# Altium schematic sheet STM32WB55 Main MCU.SchDoc
size A3; SheetNumber: 6; SheetTotal: 6
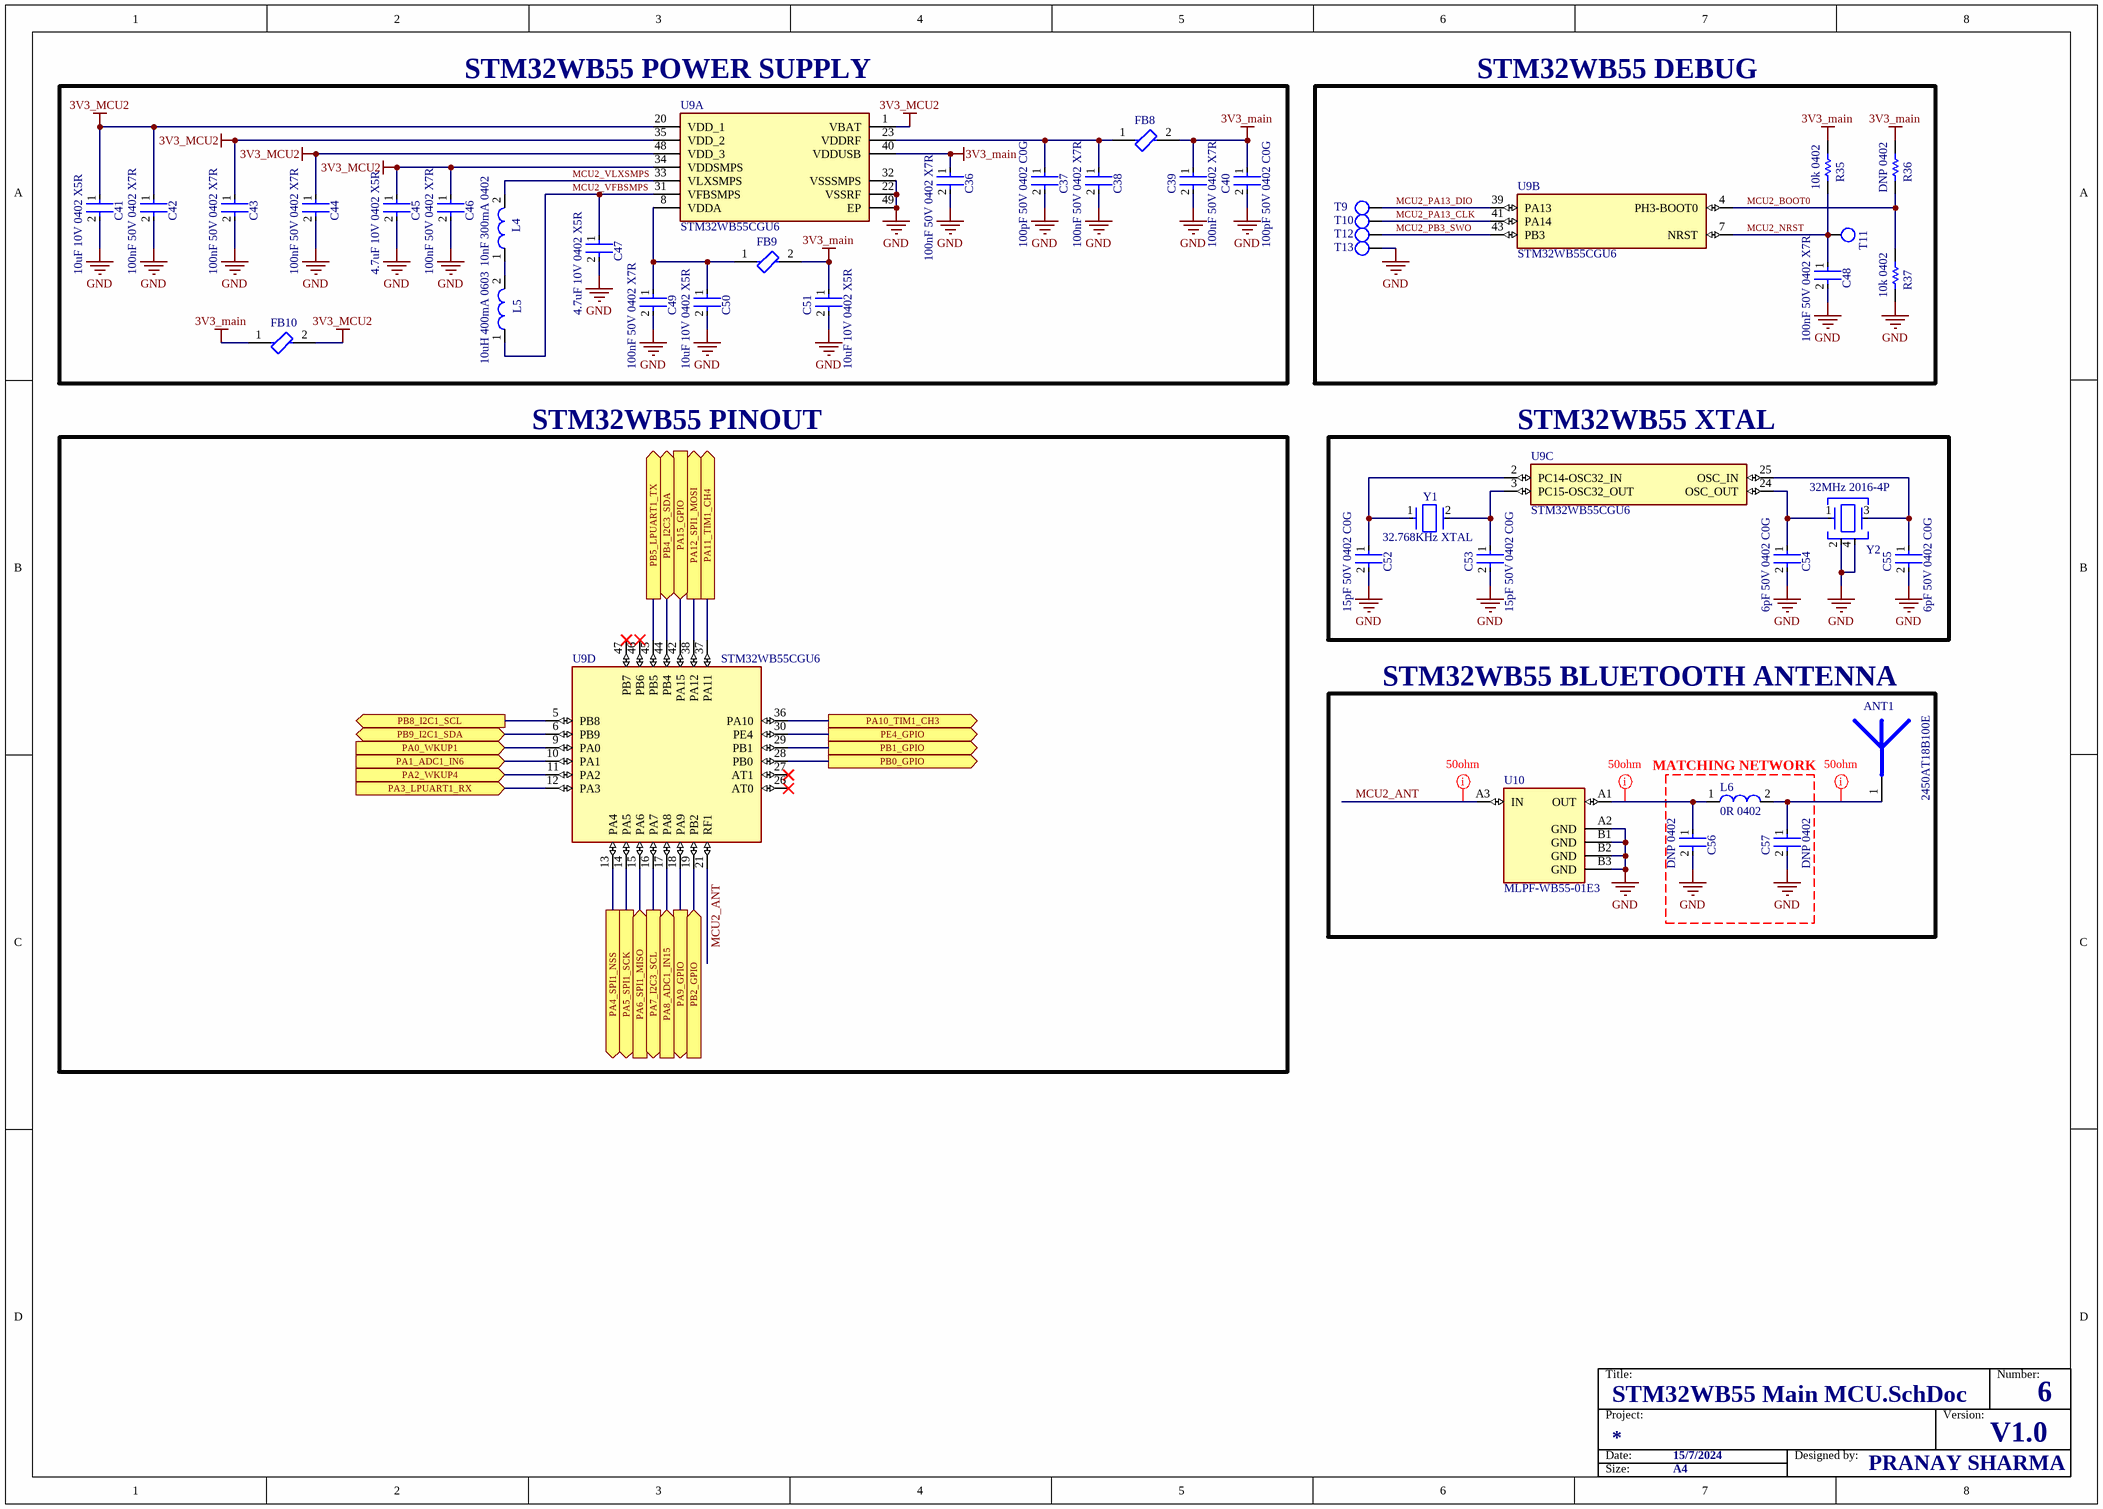
[diagram p0: STM32WB55 Main MCU.SchDoc]

## Parts
ANT1  2450AT18B100E  [2450AT18B100E IPC-C]
C36  100nF 50V 0402 X7R  [0402 IPC CLASS C CAPACITOR]
C37  100pF 50V 0402 C0G  [0402 IPC CLASS C CAPACITOR]
C38  100nF 50V 0402 X7R  [0402 IPC CLASS C CAPACITOR]
C39  100nF 50V 0402 X7R  [0402 IPC CLASS C CAPACITOR]
C40  100pF 50V 0402 C0G  [0402 IPC CLASS C CAPACITOR]
C41  10uF 10V 0402 X5R  [0402 IPC CLASS C CAPACITOR]
C42  100nF 50V 0402 X7R  [0402 IPC CLASS C CAPACITOR]
C43  100nF 50V 0402 X7R  [0402 IPC CLASS C CAPACITOR]
C44  100nF 50V 0402 X7R  [0402 IPC CLASS C CAPACITOR]
C45  4.7uF 10V 0402 X5R  [0402 IPC CLASS C CAPACITOR]
C46  100nF 50V 0402 X7R  [0402 IPC CLASS C CAPACITOR]
C47  4.7uF 10V 0402 X5R  [0402 IPC CLASS C CAPACITOR]
C48  100nF 50V 0402 X7R  [0402 IPC CLASS C CAPACITOR]
C49  100nF 50V 0402 X7R  [0402 IPC CLASS C CAPACITOR]
C50  10uF 10V 0402 X5R  [0402 IPC CLASS C CAPACITOR]
C51  10uF 10V 0402 X5R  [0402 IPC CLASS C CAPACITOR]
C52  15pF 50V 0402 C0G  [0402 IPC CLASS C CAPACITOR]
C53  15pF 50V 0402 C0G  [0402 IPC CLASS C CAPACITOR]
C54  6pF 50V 0402 C0G  [0402 IPC CLASS C CAPACITOR]
C55  6pF 50V 0402 C0G  [0402 IPC CLASS C CAPACITOR]
C56  DNP 0402  [0402 IPC CLASS C CAPACITOR]
C57  DNP 0402  [0402 IPC CLASS C CAPACITOR]
FB8  BLM15AX102SN1D  [0402 IPC CLASS C FERRITE BEAD]  (value not drawn)
FB9  BLM15AX102SN1D  [0402 IPC CLASS C FERRITE BEAD]  (value not drawn)
FB10  BLM15AX102SN1D  [0402 IPC CLASS C FERRITE BEAD]  (value not drawn)
L4  10nF 300mA 0402  [0402 IPC CLASS C FERRITE BEAD]
L5  10uH 400mA 0603  [0603 IPC CLASS C INDUCTOR]
L6  0R 0402  [0402 IPC CLASS C FERRITE BEAD]
R35  10k 0402  [0402 IPC CLASS C RESISTOR]
R36  DNP 0402  [0402 IPC CLASS C RESISTOR]  (no BOM)
R37  10k 0402  [0402 IPC CLASS C RESISTOR]
T9  Test Point TH  [Test Point TH]  (value not drawn)  (no BOM)
T10  Test Point TH  [Test Point TH]  (value not drawn)  (no BOM)
T11  Test Point TH  [Test Point TH]  (value not drawn)  (no BOM)
T12  Test Point TH  [Test Point TH]  (value not drawn)  (no BOM)
T13  Test Point TH  [Test Point TH]  (value not drawn)  (no BOM)
U9  STM32WB55CGU6  [UFQFPN48 IPC-C]  (parts A,B,C,D of 4)
U10  MLPF-WB55-01E3  [MLPF-WB55-01E3]
Y1  32.768KHz XTAL  [SMD3215-2P IPC-C]
Y2  32MHz 2016-4P  [SMD2016-4P IPC-C]

## Blocks framed on the sheet
STM32WB55 POWER SUPPLY: C36-C47 C49-C51 FB8-FB10 L4 L5 U9
STM32WB55 DEBUG: C48 R35-R37 T9-T13 U9
STM32WB55 PINOUT: U9
STM32WB55 XTAL: C52-C55 U9 Y1 Y2
STM32WB55 BLUETOOTH ANTENNA: ANT1 C56 C57 L6 U10

## Ports
PA0_WKUP1 (in), PA1_ADC1_IN6 (in), PA2_WKUP4 (in), PA3_LPUART1_RX (in), PA4_SPI1_NSS (out), PA5_SPI1_SCK (out), PA6_SPI1_MISO (in), PA7_I2C3_SCL (out), PA8_ADC1_IN15 (in), PA9_GPIO (out), PA10_TIM1_CH3 (out), PA11_TIM1_CH4 (out), PA12_SPI1_MOSI (out), PA15_GPIO (in), PB0_GPIO (out), PB1_GPIO (out), PB2_GPIO (in), PB4_I2C3_SDA (bidir), PB5_LPUART1_TX (out), PB8_I2C1_SCL (out), PB9_I2C1_SDA (bidir), PE4_GPIO (out)

## Nets
3V3_main: C36.1 C39.1 C40.1 C51.1 FB8.2 FB9.2 FB10.1 R35.2 R36.2 U9.40(VDDUSB)
3V3_MCU2: C41.1 C42.1 C43.1 C44.1 C45.1 C46.1 FB10.2 U9.1(VBAT) U9.20(VDD_1) U9.34(VDDSMPS) U9.35(VDD_2) U9.48(VDD_3)
GND: C36.2 C37.2 C38.2 C39.2 C40.2 C41.2 C42.2 C43.2 C44.2 C45.2 C46.2 C47.2 C48.2 C49.2 C50.2 C51.2 C52.2 C53.2 C54.2 C55.2 C56.2 C57.2 R37.1 T13.0 U9.22(VSSRF) U9.32(VSSSMPS) U9.49(EP) U10.A2(GND) U10.B1(GND) U10.B2(GND) U10.B3(GND) Y2.2 Y2.4
MCU2_ANT: U9.21(RF1) U10.A3(IN)
MCU2_BOOT0: R36.1 R37.2 U9.4(PH3-BOOT0)
MCU2_NRST: C48.1 R35.1 T11.0 U9.7(NRST)
MCU2_PA13_CLK: T10.0 U9.41(PA14)
MCU2_PA13_DIO: T9.0 U9.39(PA13)
MCU2_PB3_SWO: T12.0 U9.43(PB3)
MCU2_VFBSMPS: C47.1 L5.1 U9.31(VFBSMPS)
MCU2_VLXSMPS: L4.2 U9.33(VLXSMPS)
PA0_WKUP1: U9.9(PA0) ; port PA0_WKUP1
PA1_ADC1_IN6: U9.10(PA1) ; port PA1_ADC1_IN6
PA2_WKUP4: U9.11(PA2) ; port PA2_WKUP4
PA3_LPUART1_RX: U9.12(PA3) ; port PA3_LPUART1_RX
PA4_SPI1_NSS: U9.13(PA4) ; port PA4_SPI1_NSS
PA5_SPI1_SCK: U9.14(PA5) ; port PA5_SPI1_SCK
PA6_SPI1_MISO: U9.15(PA6) ; port PA6_SPI1_MISO
PA7_I2C3_SCL: U9.16(PA7) ; port PA7_I2C3_SCL
PA8_ADC1_IN15: U9.17(PA8) ; port PA8_ADC1_IN15
PA9_GPIO: U9.18(PA9) ; port PA9_GPIO
PA10_TIM1_CH3: U9.36(PA10) ; port PA10_TIM1_CH3
PA11_TIM1_CH4: U9.37(PA11) ; port PA11_TIM1_CH4
PA12_SPI1_MOSI: U9.38(PA12) ; port PA12_SPI1_MOSI
PA15_GPIO: U9.42(PA15) ; port PA15_GPIO
PB0_GPIO: U9.28(PB0) ; port PB0_GPIO
PB1_GPIO: U9.29(PB1) ; port PB1_GPIO
PB2_GPIO: U9.19(PB2) ; port PB2_GPIO
PB4_I2C3_SDA: U9.44(PB4) ; port PB4_I2C3_SDA
PB5_LPUART1_TX: U9.45(PB5) ; port PB5_LPUART1_TX
PB8_I2C1_SCL: U9.5(PB8) ; port PB8_I2C1_SCL
PB9_I2C1_SDA: U9.6(PB9) ; port PB9_I2C1_SDA
PE4_GPIO: U9.30(PE4) ; port PE4_GPIO
NetANT1_1: ANT1.1 C57.1 L6.2
NetC37_1: C37.1 C38.1 FB8.1 U9.23(VDDRF)
NetC49_1: C49.1 C50.1 FB9.1 U9.8(VDDA)
NetC52_1: C52.1 U9.2(PC14-OSC32_IN) Y1.1
NetC53_1: C53.1 U9.3(PC15-OSC32_OUT) Y1.2
NetC54_1: C54.1 U9.24(OSC_OUT) Y2.1
NetC55_1: C55.1 U9.25(OSC_IN) Y2.3
NetC56_1: C56.1 L6.1 U10.A1(OUT)
NetL4_1: L4.1 L5.2

Not connected (* = marked no-connect by the designer): U9 26(AT0)* 27(AT1)* 46(PB6)* 47(PB7)*

## Layout directives
net class 50ohm: MCU2_ANT, NetANT1_1, NetC56_1

## Notes on the sheet
- (near L6) MATCHING NETWORK
- Title:
- Number:
- Date:
- Project:
- 15/7/2024
- Designed by:
- Version:
- V1.0
- Size:
- A4
- PRANAY SHARMA

## Library data of the parts
C56 C57 = 100nF 50V 0402 X7R
L4 L6 = SDCL1005C10NJTDF
L5 = MGFL1608F100MT-LF
R35 R37 = 10k 1% 0402
R36 = 0R 1% 0402
Y1 = H31003271C2070CY